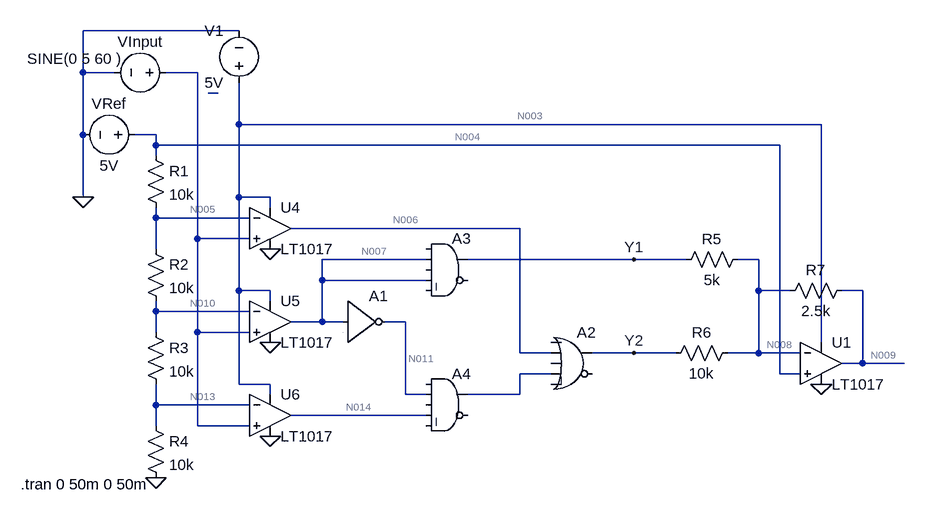
[diagram p0: schematic AD_DA.asc]
AD_DA.asc, the LTspice schematic file:
Version 4
SHEET 1 1356 680
WIRE 208 -176 -32 -176
WIRE -32 -112 -32 -176
WIRE 16 -112 -32 -112
WIRE 144 -112 96 -112
WIRE 176 -80 160 -80
WIRE 208 -32 208 -96
WIRE 1104 -32 208 -32
WIRE -32 -16 -32 -112
WIRE 80 -16 48 -16
WIRE 80 0 80 -16
WIRE 1040 0 80 0
WIRE 80 16 80 0
WIRE -32 80 -32 -16
WIRE 208 80 208 -32
WIRE 256 80 208 80
WIRE 256 96 256 80
WIRE 80 112 80 96
WIRE 224 112 80 112
WIRE 640 128 288 128
WIRE 144 144 144 -112
WIRE 224 144 144 144
WIRE 80 160 80 112
WIRE 496 176 336 176
WIRE 816 176 560 176
WIRE 896 176 816 176
WIRE 1008 176 976 176
WIRE 336 208 336 176
WIRE 496 208 336 208
WIRE 208 224 208 80
WIRE 256 224 208 224
WIRE 1008 224 1008 176
WIRE 1056 224 1008 224
WIRE 1168 224 1136 224
WIRE 256 240 256 224
WIRE 80 256 80 240
WIRE 224 256 80 256
WIRE 336 272 336 208
WIRE 336 272 288 272
WIRE 368 272 336 272
WIRE 464 272 432 272
WIRE 80 288 80 256
WIRE 144 288 144 144
WIRE 224 288 144 288
WIRE 1104 304 1104 -32
WIRE 640 320 640 128
WIRE 688 320 640 320
WIRE 816 320 752 320
WIRE 880 320 816 320
WIRE 1008 320 1008 224
WIRE 1008 320 960 320
WIRE 1072 320 1008 320
WIRE 1168 336 1168 224
WIRE 1168 336 1136 336
WIRE 1232 336 1168 336
WIRE 688 352 640 352
WIRE 1040 352 1040 0
WIRE 1072 352 1040 352
WIRE 208 368 208 224
WIRE 256 368 208 368
WIRE 256 384 256 368
WIRE 464 384 464 272
WIRE 496 384 464 384
WIRE 640 384 640 352
WIRE 640 384 560 384
WIRE 80 400 80 368
WIRE 224 400 80 400
WIRE 496 416 288 416
WIRE 80 432 80 400
WIRE 144 432 144 288
WIRE 224 432 144 432
FLAG -32 80 0
FLAG 256 160 0
FLAG 256 304 0
FLAG 256 448 0
FLAG 816 176 Y1
FLAG 816 320 Y2
FLAG 80 512 0
FLAG 1104 368 0
SYMBOL voltage 64 -16 R90
WINDOW 0 -32 56 VBottom 2
WINDOW 3 32 56 VTop 2
WINDOW 123 0 0 Left 0
WINDOW 39 0 0 Left 0
SYMATTR InstName VRef
SYMATTR Value 5V
SYMBOL voltage 112 -112 R90
WINDOW 0 -32 56 VBottom 2
WINDOW 3 -37 157 VTop 2
WINDOW 123 0 0 Left 0
WINDOW 39 0 0 Left 0
SYMATTR InstName VInput
SYMATTR Value SINE(0 5 60 )
SYMBOL res 64 0 R0
SYMATTR InstName R1
SYMATTR Value 10k
SYMBOL res 64 144 R0
SYMATTR InstName R2
SYMATTR Value 10k
SYMBOL res 64 272 R0
SYMATTR InstName R3
SYMATTR Value 10k
SYMBOL res 64 416 R0
SYMATTR InstName R4
SYMATTR Value 10k
SYMBOL voltage 208 -80 R180
WINDOW 0 24 96 Left 2
WINDOW 3 24 16 Left 2
WINDOW 123 0 0 Left 0
WINDOW 39 0 0 Left 0
SYMATTR InstName V1
SYMATTR Value 5V
SYMBOL Comparators\\LT1017 256 128 R0
SYMATTR InstName U4
SYMBOL Comparators\\LT1017 256 272 R0
SYMATTR InstName U5
SYMBOL Comparators\\LT1017 256 416 R0
SYMATTR InstName U6
SYMBOL Digital\\inv 368 208 R0
SYMATTR InstName A1
SYMBOL Digital\\and 528 128 R0
SYMATTR InstName A3
SYMBOL Digital\\and 528 336 R0
SYMATTR InstName A4
SYMBOL Digital\\or 720 272 R0
SYMATTR InstName A2
SYMBOL res 992 160 R90
WINDOW 0 0 56 VBottom 2
WINDOW 3 32 56 VTop 2
SYMATTR InstName R5
SYMATTR Value 5k
SYMBOL res 976 304 R90
WINDOW 0 0 56 VBottom 2
WINDOW 3 32 56 VTop 2
SYMATTR InstName R6
SYMATTR Value 10k
SYMBOL res 1152 208 R90
WINDOW 0 0 56 VBottom 2
WINDOW 3 32 56 VTop 2
SYMATTR InstName R7
SYMATTR Value 2.5k
SYMBOL Comparators\\LT1017 1104 336 R0
SYMATTR InstName U1
TEXT -128 522 Left 2 !.tran 0 50m 0 50m

The netlist it stands for:
* AD_DA.asc
VRef N004 0 5V
VInput N001 0 SINE(0 5 60 )
R1 N004 N005 10k
R2 N005 N010 10k
R3 N010 N013 10k
R4 N013 0 10k
V1 N003 0 5V
XU4 N001 N005 N003 0 N006 LT1017  ; pins In+ In- V+ V- OUT
XU5 N001 N010 N003 0 N007 LT1017  ; pins In+ In- V+ V- OUT
XU6 N001 N013 N003 0 N014 LT1017  ; pins In+ In- V+ V- OUT
A1 N007 0 0 0 0 N011 0 0 BUF
A3 0 N007 0 N007 0 0 Y1 0 AND
A4 0 N011 0 N014 0 0 N012 0 AND
A2 0 N006 0 N012 0 0 Y2 0 OR
R5 N008 Y1 5k
R6 N008 Y2 10k
R7 N009 N008 2.5k
XU1 N004 N008 N003 0 N009 LT1017  ; pins In+ In- V+ V- OUT
.tran 0 50m 0 50m
.backanno
.end

* Results of the author's LTspice run, read from the files saved beside the schematic
* Operating Point, zero values left out:
*   V(n004) = 5 V
*   V(n005) = 3.75 V
*   V(n010) = 2.5 V
*   V(n013) = 1.25 V
*   V(n003) = 5 V
*   V(n006) = 48.4 mV
*   V(n007) = 48.4 mV
*   V(n014) = 48.4 mV
*   V(n011) = 1 V
*   V(y1) = 52.62 µV
*   V(y2) = 26.31 µV
*   V(n008) = 263.1 mV
*   V(n009) = 460.4 mV
*   I(R7) = 78.92 µA
*   I(R6) = 26.31 µA
*   I(R5) = 52.62 µA
*   I(R4) = 125 µA
*   I(R3) = 125 µA
*   I(R2) = 125 µA
*   I(R1) = 125 µA
*   I(V1) = -521.5 µA
*   I(Vinput) = 9 nA
*   I(Vref) = -125 µA
*   I8(A2) = -26.31 µA
*   I7(A2) = 26.31 µA
*   I8(A3) = -52.62 µA
*   I7(A3) = 52.62 µA
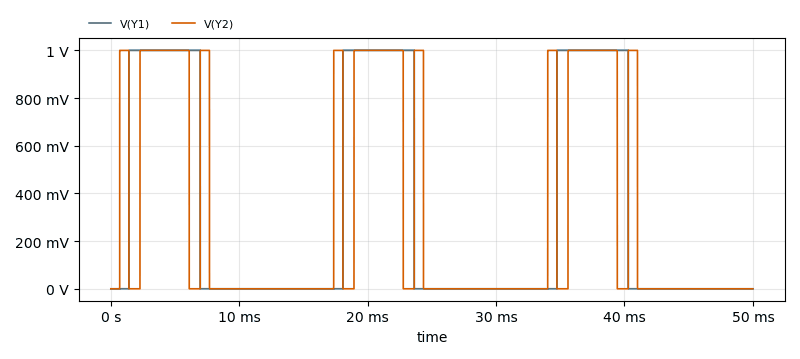
[diagram p1: Transient Analysis of AD_DA.asc, plotted from the saved traces]
* Transient Analysis, 1 run:
*   V(Y1): min 52.58 µV, max 1 V, average 333.2 mV, rms 577.2 mV, last 52.62 µV
*   V(Y2): min 26.29 µV, max 1 V, average 316.2 mV, rms 562.3 mV, last 26.31 µV